# Altium schematic sheet Support.SchDoc
size A4
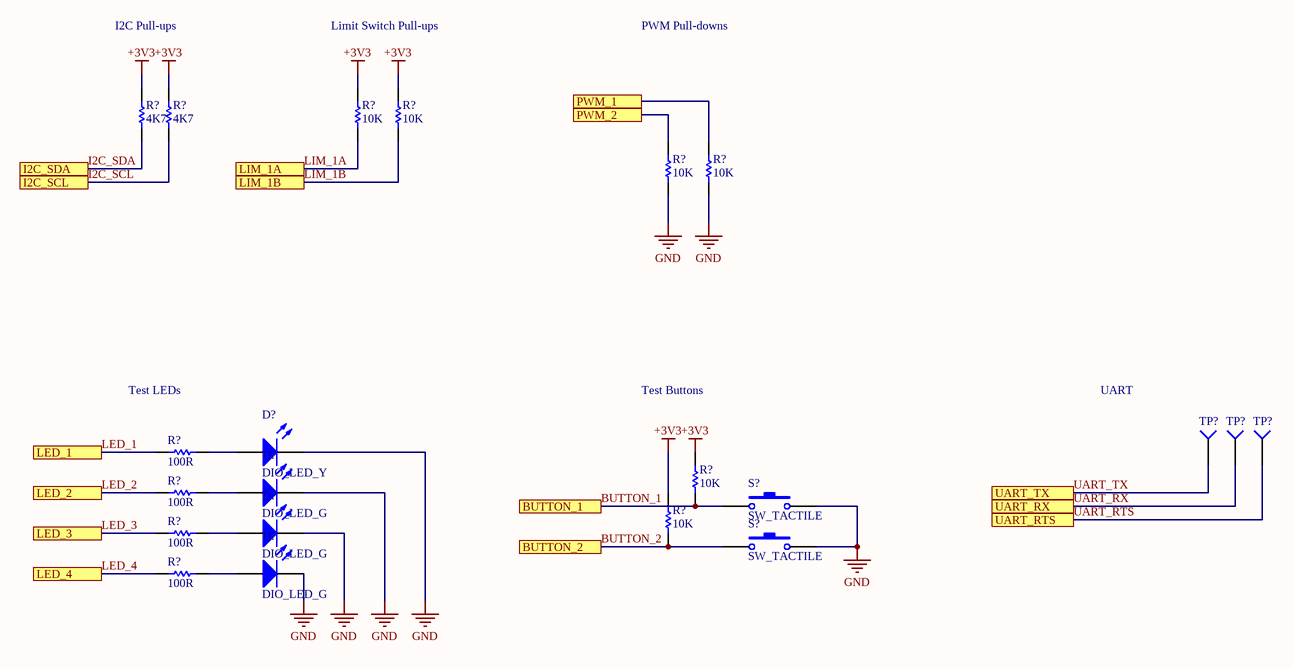
[diagram p0: Support.SchDoc]

## Parts
(Parts that share a designator on the sheet are numbered #1, #2 ... from top to bottom, then left to right.)
D?#1  DIO_LED_Y  [LED_0805]
D?#2  DIO_LED_G  [LED_0805]
D?#3  DIO_LED_G  [LED_0805]
D?#4  DIO_LED_G  [LED_0805]
R?#1  value 4K7  [RESC0201(0603)_N]  (hidden comment: RES_4K7_0603)
R?#2  value 4K7  [RESC0201(0603)_N]  (hidden comment: RES_4K7_0603)
R?#3  value 10K  [RESC0201(0603)_N]  (hidden comment: RES_10K_0603)
R?#4  value 10K  [RESC0201(0603)_N]  (hidden comment: RES_10K_0603)
R?#5  value 10K  [RESC0201(0603)_N]  (hidden comment: RES_10K_0603)
R?#6  value 10K  [RESC0201(0603)_N]  (hidden comment: RES_10K_0603)
R?#7  value 100R  [RESC0201(0603)_N]  (hidden comment: RES_100R_0603)
R?#8  value 100R  [RESC0201(0603)_N]  (hidden comment: RES_100R_0603)
R?#9  value 10K  [RESC0201(0603)_N]  (hidden comment: RES_10K_0603)
R?#10  value 10K  [RESC0201(0603)_N]  (hidden comment: RES_10K_0603)
R?#11  value 100R  [RESC0201(0603)_N]  (hidden comment: RES_100R_0603)
R?#12  value 100R  [RESC0201(0603)_N]  (hidden comment: RES_100R_0603)
S?#1  SW_TACTILE  [SPST-2]
S?#2  SW_TACTILE  [SPST-2]
TP?#1  TESTPOINT  (value not drawn)
TP?#2  TESTPOINT  (value not drawn)
TP?#3  TESTPOINT  (value not drawn)

## Ports
BUTTON_1, BUTTON_2, I2C_SCL, I2C_SDA, LED_1, LED_2, LED_3, LED_4, LIM_1A, LIM_1B, PWM_1, PWM_2, UART_RTS, UART_RX, UART_TX

## Nets
+3V3: R?#1.2 R?#2.2 R?#3.2 R?#4.2 R?#9.2 R?#10.1
GND: D?#1.2(K) D?#2.2(K) D?#3.2(K) D?#4.2(K) R?#5.1 R?#6.1 S?#1.2 S?#2.2
BUTTON_1: R?#9.1 S?#1.1 ; port BUTTON_1
BUTTON_2: R?#10.2 S?#2.1 ; port BUTTON_2
I2C_SCL: R?#2.1 ; port I2C_SCL
I2C_SDA: R?#1.1 ; port I2C_SDA
LED_1: R?#7.1 ; port LED_1
LED_2: R?#8.1 ; port LED_2
LED_3: R?#11.1 ; port LED_3
LED_4: R?#12.1 ; port LED_4
LIM_1A: R?#3.1 ; port LIM_1A
LIM_1B: R?#4.1 ; port LIM_1B
PWM_1: R?#6.2 ; port PWM_1
PWM_2: R?#5.2 ; port PWM_2
UART_RTS: TP?#3.1(=value) ; port UART_RTS
UART_RX: TP?#2.1(=value) ; port UART_RX
UART_TX: TP?#1.1(=value) ; port UART_TX
NetD?#1_1: D?#1.1(A) R?#7.2
NetD?#2_1: D?#2.1(A) R?#8.2
NetD?#3_1: D?#3.1(A) R?#11.2
NetD?#4_1: D?#4.1(A) R?#12.2

## Notes on the sheet
- I2C Pull-ups
- Limit Switch Pull-ups
- PWM Pull-downs
- Test LEDs
- Test Buttons
- UART

## Library data of the parts
D?#1 = DIO_LED_Y: LED YELLOW DIFFUSED 0805 SMD; Part Number: LY R976-PS-36; Manufacturer: OSRAM; Forward Voltage Drop: 2.2V; Package: 0805 (2012 Metric)
D?#2-D?#4 = DIO_LED_G: LED GREEN DIFFUSED 0805 SMD; Part Number: LG R971-KN-1; Manufacturer: OSRAM; Forward Voltage Drop: 2.2V; Package: 0805 (2012 Metric)
R?#1 R?#2 = RES_4K7_0603: RES SMD 4.7K OHM 5% 1/10W 0603; Manufacturer: Yageo; Part Number (MPN): RC0603JR-074K7L; Package: 0603 (1608 Metric); Dimensions: 0.063" L x 0.031" W (1.60mm x 0.80mm); Tolerance: 5%
R?#3-R?#6 R?#9 R?#10 = RES_10K_0603: RES SMD 10K OHM 5% 1/10W 0603; Manufacturer: Yageo; Part Number (MPN): RC0603JR-0710KL; Package: 0603 (1608 Metric); Dimensions: 0.063" L x 0.031" W (1.60mm x 0.80mm); Tolerance: 5%
R?#7 R?#8 R?#11 R?#12 = RES_100R_0603: RES SMD 100 OHM 1% 1/10W 0603; Manufacturer: Yageo; Part Number (MPN): RC0603FR-07100RL; Package: 0603 (1608 Metric); Dimensions: 0.063" L x 0.031" W (1.60mm x 0.80mm); Tolerance: 1%
S?#1 S?#2 = SW_TACTILE: Switch; Published: 24-Mar-1999; LatestRevisionDate: 17-Jul-2002; LatestRevisionNote: Re-released for DXP Platform.; PackageReference: SPST-2; Publisher: Altium Limited; PackageDescription: Switch; 2 Leads